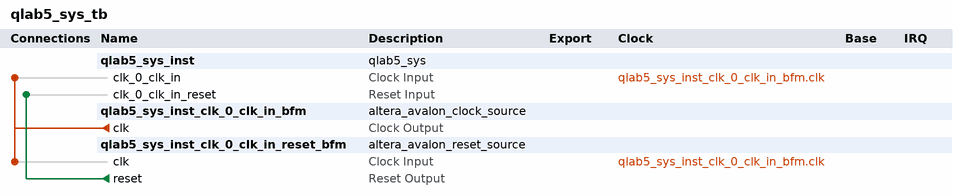
[diagram p0: system contents]
# Platform Designer (Qsys) system qlab5_sys_tb, Cyclone II EP2C5Q208C8
# Parameters at their usual value, and those the tool derives, are not listed.
package require -exact qsys 12.1
create_system qlab5_sys_tb
set_project_property DEVICE_FAMILY {Cyclone II}
set_project_property DEVICE EP2C5Q208C8

add_instance qlab5_sys_inst qlab5_sys 1.0

add_instance qlab5_sys_inst_clk_0_clk_in_bfm altera_avalon_clock_source 12.1

add_instance qlab5_sys_inst_clk_0_clk_in_reset_bfm altera_avalon_reset_source 12.1
set_instance_parameter_value qlab5_sys_inst_clk_0_clk_in_reset_bfm ASSERT_HIGH_RESET 0
set_instance_parameter_value qlab5_sys_inst_clk_0_clk_in_reset_bfm INITIAL_RESET_CYCLES 50

# connections
add_connection qlab5_sys_inst_clk_0_clk_in_bfm.clk qlab5_sys_inst.clk_0_clk_in clock
add_connection qlab5_sys_inst_clk_0_clk_in_bfm.clk qlab5_sys_inst_clk_0_clk_in_reset_bfm.clk clock
add_connection qlab5_sys_inst_clk_0_clk_in_reset_bfm.reset qlab5_sys_inst.clk_0_clk_in_reset reset

save_system qlab5_sys_tb.qsys
